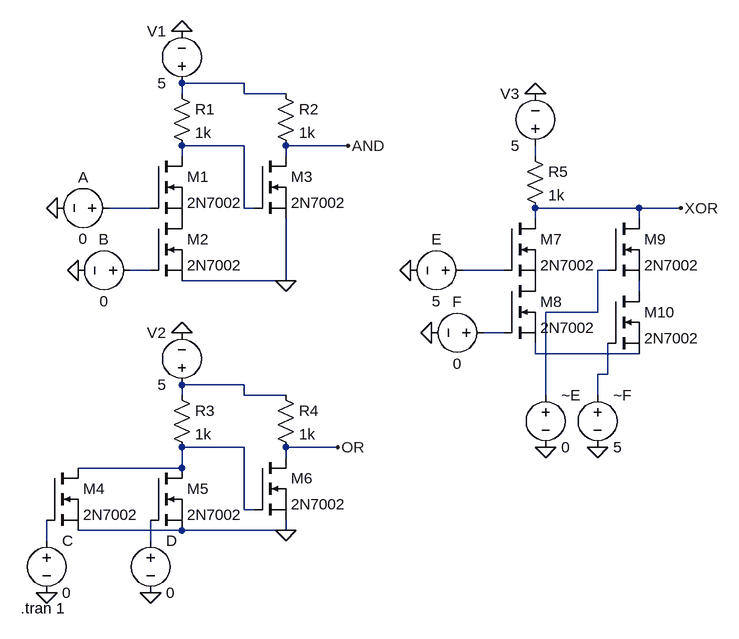
[diagram p0: schematic NMOS Logic.asc]
NMOS Logic.asc, the LTspice schematic file:
Version 4
SHEET 1 1892 888
WIRE 1152 64 1056 64
WIRE 1056 80 1056 64
WIRE 1152 80 1152 64
WIRE 1216 80 1152 80
WIRE 1152 160 1056 160
WIRE 1312 160 1216 160
WIRE 1056 176 1056 160
WIRE 1216 176 1216 160
WIRE 1600 176 1600 160
WIRE 1008 256 944 256
WIRE 1152 256 1152 160
WIRE 1168 256 1152 256
WIRE 1760 256 1600 256
WIRE 1824 256 1760 256
WIRE 1600 272 1600 256
WIRE 1760 272 1760 256
WIRE 1008 352 976 352
WIRE 1552 352 1488 352
WIRE 1712 352 1696 352
WIRE 1216 368 1216 272
WIRE 1216 368 1056 368
WIRE 1760 384 1760 368
WIRE 1696 416 1696 352
WIRE 1696 416 1616 416
WIRE 1552 448 1520 448
WIRE 1600 480 1600 464
WIRE 1760 480 1600 480
WIRE 1712 512 1712 464
WIRE 1712 512 1696 512
WIRE 1152 528 1056 528
WIRE 1056 544 1056 528
WIRE 1152 544 1152 528
WIRE 1216 544 1152 544
WIRE 1616 544 1616 416
WIRE 1696 544 1696 512
WIRE 1152 624 1056 624
WIRE 1296 624 1216 624
WIRE 1216 640 1216 624
WIRE 1056 656 1056 624
WIRE 1056 656 896 656
WIRE 1152 720 1152 624
WIRE 1168 720 1152 720
WIRE 1056 752 896 752
WIRE 1216 752 1216 736
WIRE 1216 752 1056 752
WIRE 848 768 848 736
WIRE 1008 768 1008 736
FLAG 1056 -16 0
FLAG 1216 368 0
FLAG 864 256 0
FLAG 896 352 0
FLAG 1312 160 AND
FLAG 1056 448 0
FLAG 1216 752 0
FLAG 848 848 0
FLAG 1008 848 0
FLAG 1296 624 OR
FLAG 1600 80 0
FLAG 1408 352 0
FLAG 1440 448 0
FLAG 1696 624 0
FLAG 1616 624 0
FLAG 1824 256 XOR
SYMBOL voltage 1056 80 R180
WINDOW 0 24 96 Left 2
WINDOW 3 24 16 Left 2
WINDOW 123 0 0 Left 0
WINDOW 39 0 0 Left 0
SYMATTR InstName V1
SYMATTR Value 5
SYMBOL voltage 960 256 R90
WINDOW 0 -32 56 VBottom 2
WINDOW 3 32 56 VTop 2
WINDOW 123 0 0 Left 0
WINDOW 39 0 0 Left 0
SYMATTR InstName A
SYMATTR Value 0
SYMBOL voltage 992 352 R90
WINDOW 0 -32 56 VBottom 2
WINDOW 3 32 56 VTop 2
WINDOW 123 0 0 Left 0
WINDOW 39 0 0 Left 0
SYMATTR InstName B
SYMATTR Value 0
SYMBOL res 1040 64 R0
SYMATTR InstName R1
SYMATTR Value 1k
SYMBOL res 1200 64 R0
SYMATTR InstName R2
SYMATTR Value 1k
SYMBOL nmos 1008 176 R0
SYMATTR InstName M1
SYMATTR Value 2N7002
SYMBOL nmos 1008 272 R0
SYMATTR InstName M2
SYMATTR Value 2N7002
SYMBOL nmos 1168 176 R0
SYMATTR InstName M3
SYMATTR Value 2N7002
SYMBOL voltage 1056 544 R180
WINDOW 0 24 96 Left 2
WINDOW 3 24 16 Left 2
WINDOW 123 0 0 Left 0
WINDOW 39 0 0 Left 0
SYMATTR InstName V2
SYMATTR Value 5
SYMBOL voltage 848 752 R0
WINDOW 123 0 0 Left 0
WINDOW 39 0 0 Left 0
SYMATTR InstName C
SYMATTR Value 0
SYMBOL voltage 1008 752 R0
WINDOW 123 0 0 Left 0
WINDOW 39 0 0 Left 0
SYMATTR InstName D
SYMATTR Value 0
SYMBOL res 1040 528 R0
SYMATTR InstName R3
SYMATTR Value 1k
SYMBOL res 1200 528 R0
SYMATTR InstName R4
SYMATTR Value 1k
SYMBOL nmos 848 656 R0
SYMATTR InstName M4
SYMATTR Value 2N7002
SYMBOL nmos 1008 656 R0
SYMATTR InstName M5
SYMATTR Value 2N7002
SYMBOL nmos 1168 640 R0
SYMATTR InstName M6
SYMATTR Value 2N7002
SYMBOL voltage 1600 176 R180
WINDOW 0 24 96 Left 2
WINDOW 3 24 16 Left 2
WINDOW 123 0 0 Left 0
WINDOW 39 0 0 Left 0
SYMATTR InstName V3
SYMATTR Value 5
SYMBOL voltage 1504 352 R90
WINDOW 0 -32 56 VBottom 2
WINDOW 3 32 56 VTop 2
WINDOW 123 0 0 Left 0
WINDOW 39 0 0 Left 0
SYMATTR InstName E
SYMATTR Value 5
SYMBOL voltage 1536 448 R90
WINDOW 0 -32 56 VBottom 2
WINDOW 3 32 56 VTop 2
WINDOW 123 0 0 Left 0
WINDOW 39 0 0 Left 0
SYMATTR InstName F
SYMATTR Value 0
SYMBOL res 1584 160 R0
SYMATTR InstName R5
SYMATTR Value 1k
SYMBOL nmos 1552 272 R0
SYMATTR InstName M7
SYMATTR Value 2N7002
SYMBOL nmos 1552 368 R0
SYMATTR InstName M8
SYMATTR Value 2N7002
SYMBOL nmos 1712 272 R0
SYMATTR InstName M9
SYMATTR Value 2N7002
SYMBOL nmos 1712 384 R0
SYMATTR InstName M10
SYMATTR Value 2N7002
SYMBOL voltage 1616 528 R0
WINDOW 123 0 0 Left 0
WINDOW 39 0 0 Left 0
SYMATTR InstName ~E
SYMATTR Value 0
SYMBOL voltage 1696 528 R0
WINDOW 123 0 0 Left 0
WINDOW 39 0 0 Left 0
SYMATTR InstName ~F
SYMATTR Value 5
TEXT 808 872 Left 2 !.tran 1

The netlist it stands for:
* NMOS Logic.asc
V1 N001 0 5
V§A N004 0 0
V§B N005 0 0
R1 N001 N002 1k
R2 N001 AND 1k
M1 N002 N004 P001 P001 2N7002
M2 P001 N005 0 0 2N7002
M3 AND N002 0 0 2N7002
V2 N012 0 5
V§C N014 0 0
V§D N015 0 0
R3 N012 N013 1k
R4 N012 OR 1k
M4 N013 N014 0 0 2N7002
M5 N013 N015 0 0 2N7002
M6 OR N013 0 0 2N7002
V3 N003 0 5
V§E N006 0 5
V§F N009 0 0
R5 N003 XOR 1k
M7 XOR N006 P002 P002 2N7002
M8 P002 N009 N010 N010 2N7002
M9 XOR N007 N008 N008 2N7002
M10 N008 N011 N010 N010 2N7002
V§~E N007 0 0
V§~F N011 0 5
.model NMOS NMOS
.model PMOS PMOS
.lib standard.mos
.tran 1
.backanno
.end